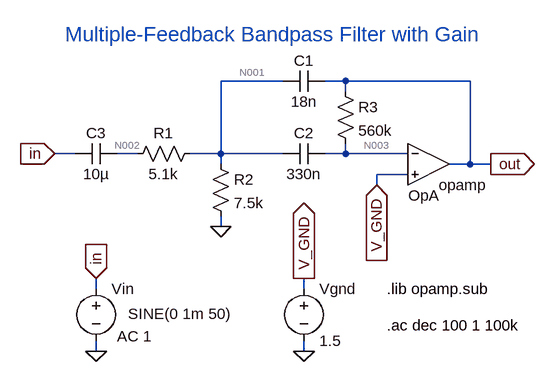
[diagram p0: schematic MF_bandpass.asc]
MF_bandpass.asc, the LTspice schematic file:
Version 4
SHEET 1 880 680
WIRE 208 -208 112 -208
WIRE 304 -208 272 -208
WIRE 496 -208 304 -208
WIRE 304 -192 304 -208
WIRE -112 -96 -144 -96
WIRE -16 -96 -48 -96
WIRE 112 -96 112 -208
WIRE 112 -96 64 -96
WIRE 208 -96 112 -96
WIRE 304 -96 304 -112
WIRE 304 -96 272 -96
WIRE 400 -96 304 -96
WIRE 112 -80 112 -96
WIRE 496 -80 496 -208
WIRE 496 -80 464 -80
WIRE 528 -80 496 -80
WIRE 400 -64 352 -64
WIRE 352 -48 352 -64
WIRE 112 16 112 0
WIRE -80 112 -80 96
WIRE 240 112 240 96
WIRE -80 208 -80 192
WIRE 240 208 240 192
FLAG -80 208 0
FLAG -80 96 in
IOPIN -80 96 In
FLAG 352 -48 V_GND
IOPIN 352 -48 In
FLAG -144 -96 in
IOPIN -144 -96 In
FLAG 528 -80 out
IOPIN 528 -80 Out
FLAG 240 208 0
FLAG 240 96 V_GND
IOPIN 240 96 Out
FLAG 112 16 0
SYMBOL OpAmps\\opamp 432 -144 R0
WINDOW 0 -31 112 Left 2
SYMATTR InstName OpA
SYMBOL voltage -80 96 R0
WINDOW 123 32 89 Left 2
WINDOW 39 0 0 Left 0
WINDOW 3 49 55 Left 2
SYMATTR Value2 AC 1
SYMATTR InstName Vin
SYMATTR Value SINE(0 1m 50)
SYMBOL cap -48 -112 R90
WINDOW 0 0 32 VBottom 2
WINDOW 3 32 32 VTop 2
SYMATTR InstName C3
SYMATTR Value 10µ
SYMBOL voltage 240 96 R0
WINDOW 123 24 124 Left 2
WINDOW 39 0 0 Left 0
SYMATTR InstName Vgnd
SYMATTR Value 1.5
SYMBOL res 80 -112 R90
WINDOW 0 0 56 VBottom 2
WINDOW 3 32 56 VTop 2
SYMATTR InstName R1
SYMATTR Value 5.1k
SYMBOL cap 272 -112 R90
WINDOW 0 0 32 VBottom 2
WINDOW 3 32 32 VTop 2
SYMATTR InstName C2
SYMATTR Value 330n
SYMBOL res 96 -96 R0
SYMATTR InstName R2
SYMATTR Value 7.5k
SYMBOL res 288 -208 R0
SYMATTR InstName R3
SYMATTR Value 560k
SYMBOL cap 272 -224 R90
WINDOW 0 0 32 VBottom 2
WINDOW 3 32 32 VTop 2
SYMATTR InstName C1
SYMATTR Value 18n
TEXT 368 112 Left 2 !.lib opamp.sub
TEXT 368 168 Left 2 !.ac dec 100 1 100k
TEXT -128 -280 Left 3 ;Multiple-Feedback Bandpass Filter with Gain

The netlist it stands for:
* MF_bandpass.asc
XOpA N003 V_GND out opamp Aol=100K GBW=10Meg  ; pins invin noninvin out
Vin in 0 SINE(0 1m 50) AC 1
C3 N002 in 10µ
Vgnd V_GND 0 1.5
R1 N001 N002 5.1k
C2 N003 N001 330n
R2 N001 0 7.5k
R3 out N003 560k
C1 out N001 18n
.lib opamp.sub
.ac dec 100 1 100k
* Multiple-Feedback Bandpass Filter with Gain
.backanno
.end

* Results of the author's LTspice run, read from the files saved beside the schematic
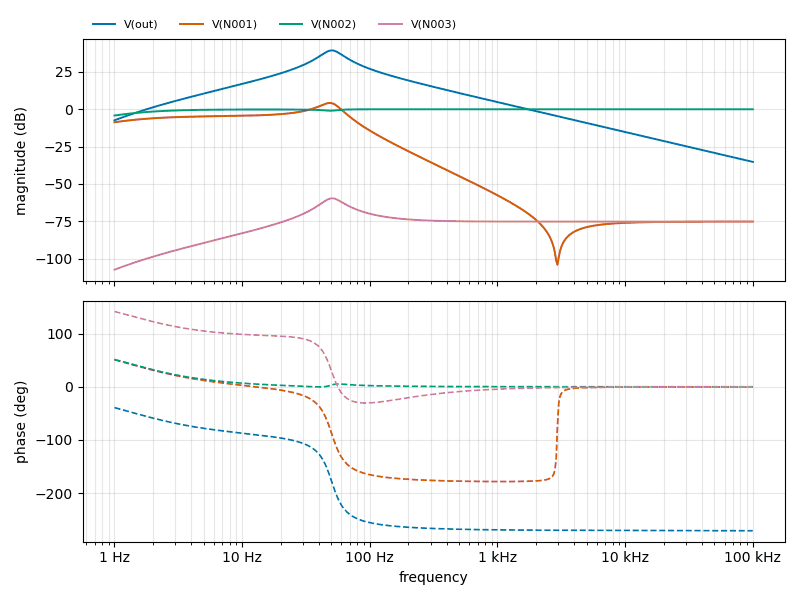
[diagram p1: AC Analysis of MF_bandpass.asc, plotted from the saved traces]
* AC Analysis, 1 run:
*   V(out): -7.39 dB at 1 Hz, -35.22 dB at 100 kHz, peak 39.41 dB at 50.12 Hz, 3 dB below the peak at 41.93 Hz and 60.49 Hz
*   V(N001): -8.68 dB at 1 Hz, -75.23 dB at 100 kHz, peak 4.21 dB at 48.98 Hz, 3 dB below the peak at 38.02 Hz and 57.3 Hz
*   V(N002): -4.18 dB at 1 Hz, -0.00 dB at 100 kHz, peak -0.00 dB at 100 kHz, 3 dB below the peak at 1.278 Hz
*   V(N003): -107.39 dB at 1 Hz, -75.22 dB at 100 kHz, peak -59.62 dB at 51.29 Hz, 3 dB below the peak at 42.39 Hz and 61.56 Hz